# EAGLE design VelocistaEdu_soloshield (EAGLE 7.1.0)
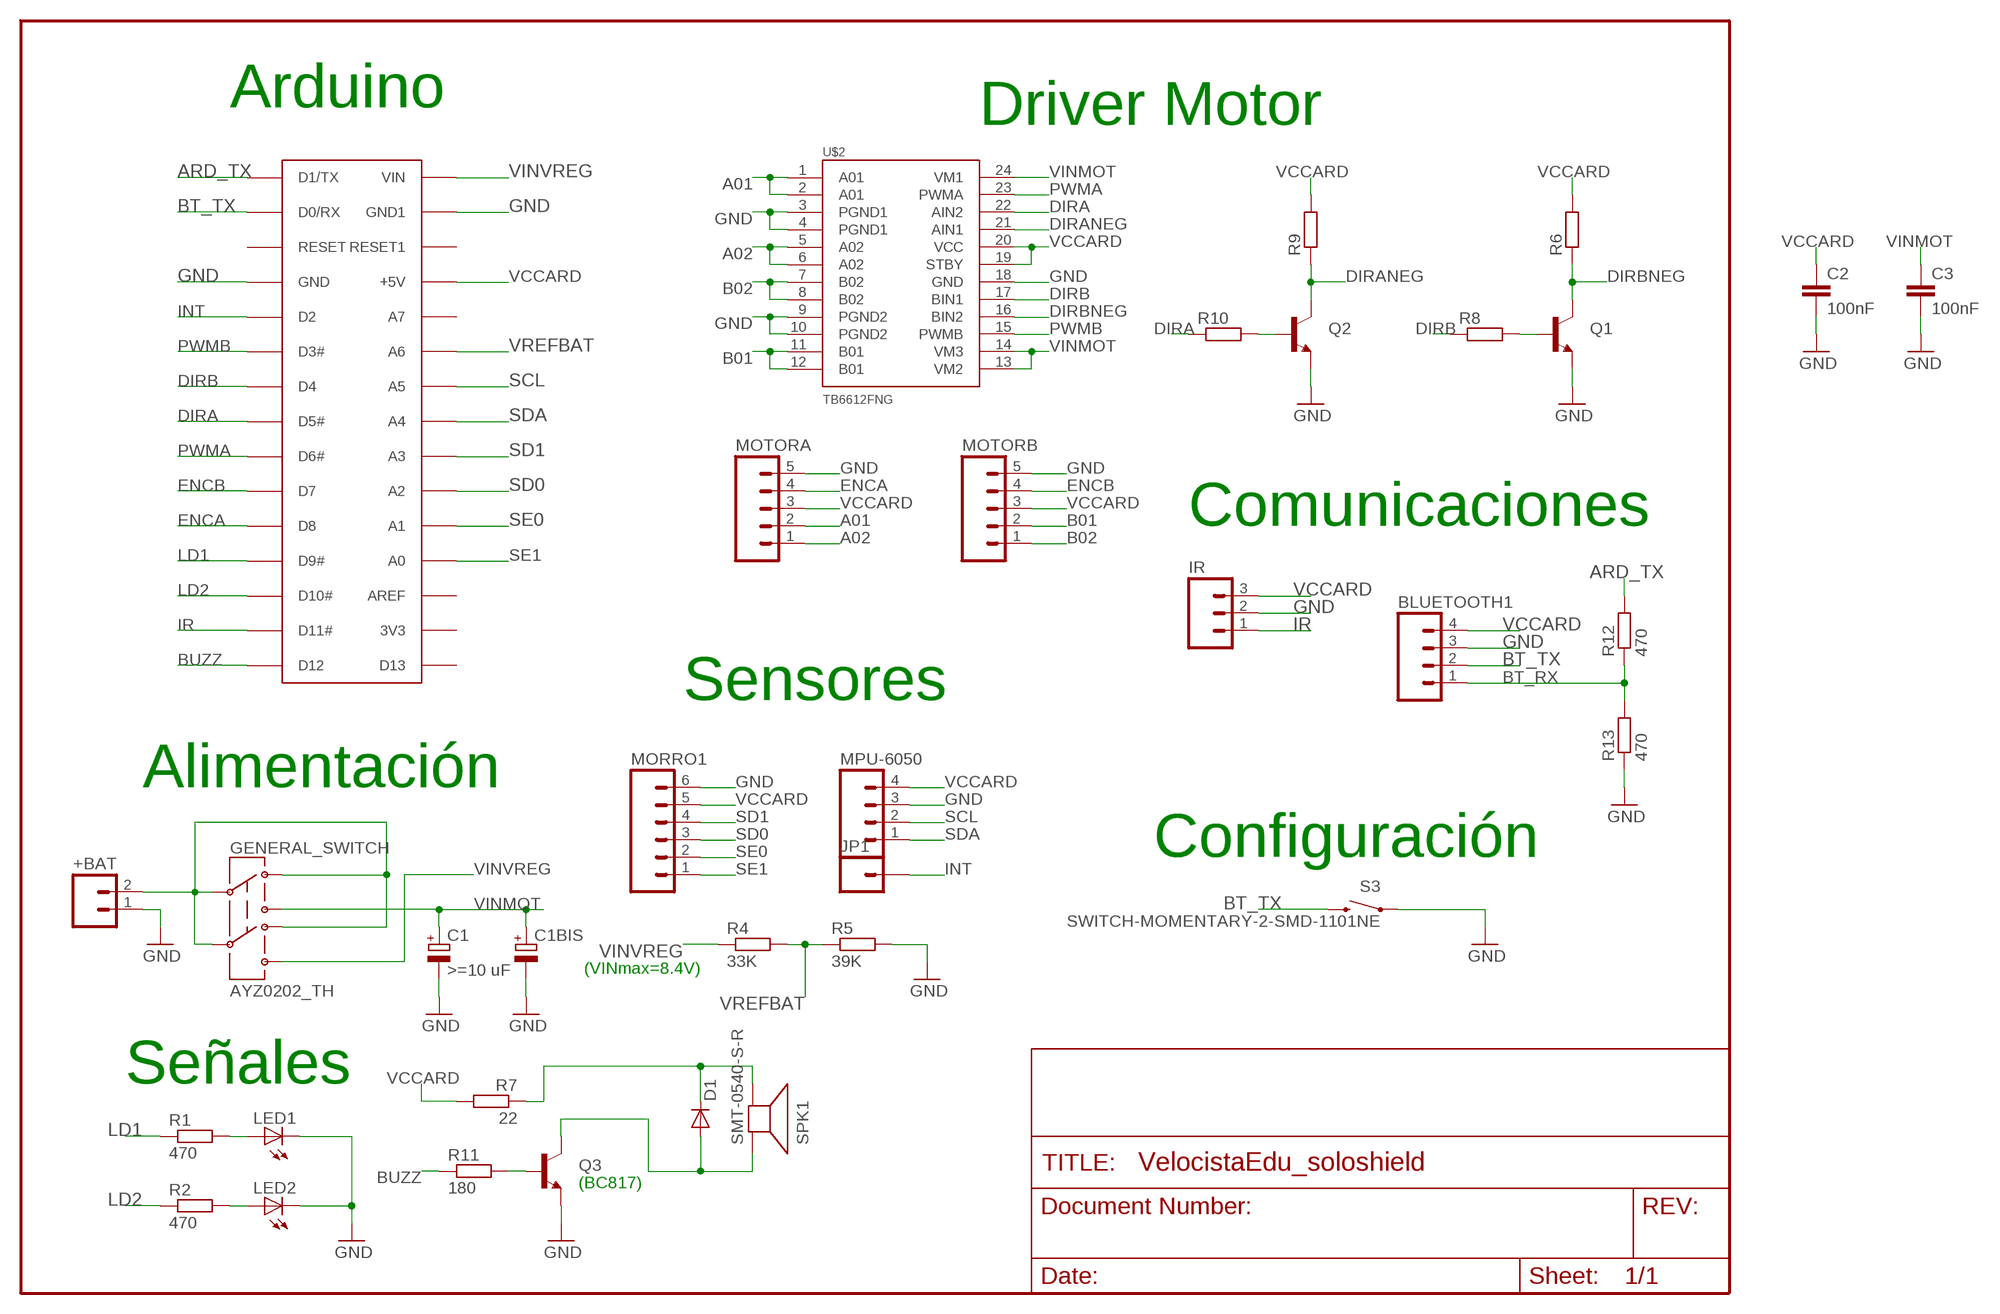
[diagram p0: schematic, sheet 1]

## Parts
+BAT  M02LOCK_LONGPADS  [1X02_LOCK_LONGPADS]
BLUETOOTH1  M04LONGPADS  [1X04_LONGPADS]
C1  >=10 uF  CPOL-EUSMCC  [SMC_C]
C1BIS  CPOL-EUE2.5-5  [E2,5-5]
C2  100nF  C-EUC0805  [C0805]
C3  100nF  C-EUC0805  [C0805]
D1  DIODE-MICROMELF-W  [MICROMELF-W]
GENERAL_SWITCH  AYZ0202_TH  [AYZ0202_TH]
IR  M03LONGPADS  [1X03_LONGPADS]
JP1  M01PTH_LONGPAD  [1X01_LONGPAD]
LED1  LEDCHIPLED_0805  [CHIPLED_0805]
LED2  LEDCHIPLED_0805  [CHIPLED_0805]
MORRO1  M06LONGPADS  [1X06_LONGPADS]
MOTORA  M05PTH  [1X05]
MOTORB  M05PTH  [1X05]
MPU-6050  M04LONGPADS  [1X04_LONGPADS]
Q1  TRANSISTOR_NPNSOT23  [SOT23]
Q2  TRANSISTOR_NPNSOT23  [SOT23]
Q3  TRANSISTOR_NPNSOT23  [SOT23]
R1  470  R-EU_R0805  [R0805]
R2  470  R-EU_R0805  [R0805]
R4  33K  R-EU_R0805  [R0805]
R5  39K  R-EU_R0805  [R0805]
R6  R-EU_M0805  [M0805]
R7  22  R-EU_R0805  [R0805]
R8  R-EU_M0805  [M0805]
R9  R-EU_M0805  [M0805]
R10  R-EU_M0805  [M0805]
R11  180  R-EU_M0805  [M0805]
R12  470  R-EU_R0805  [R0805]
R13  470  R-EU_R0805  [R0805]
S3  SWITCH-MOMENTARY-2-SMD-1101NE  [TACTILE-SWITCH-1101NE]
SPK1  SMT-0540-S-R  [SMT-0540-S-R]
U$1  ARDUINONANONOHOLES  [PDIP-32NOHOLES]
U$2  TB6612FNG  [SSOP24]

## Nets
A01: MOTORA.2 U$2.1(A01) U$2.2(A01)
A02: MOTORA.1 U$2.5(A02) U$2.6(A02)
ARD_TX: R12.2 U$1.D1/TX
B01: MOTORB.2 U$2.11(B01) U$2.12(B01)
B02: MOTORB.1 U$2.7(B02) U$2.8(B02)
BT_RX: BLUETOOTH1.1 R12.1 R13.2
BT_TX: BLUETOOTH1.2 S3.P$2 U$1.D0/RX
BUZZ: R11.1 U$1.D12
DIRA: R10.1 U$1.D5(D5#) U$2.22(AIN2)
DIRANEG: Q2.3(C) R9.1 U$2.21(AIN1)
DIRB: R8.1 U$1.D4 U$2.17(BIN1)
DIRBNEG: Q1.3(C) R6.1 U$2.16(BIN2)
ENCA: MOTORA.4 U$1.D8
ENCB: MOTORB.4 U$1.D7
GND: +BAT.1 BLUETOOTH1.3 C1.- C1BIS.- C2.2 C3.2 IR.2 LED1.C LED2.C MORRO1.6 MOTORA.5 MOTORB.5 MPU-6050.3 Q1.2(E) Q2.2(E) Q3.2(E) R5.2 R13.1 S3.P$1 U$1.GND U$1.GND1 U$2.3(PGND1) U$2.4(PGND1) U$2.9(PGND2) U$2.10(PGND2) U$2.18(GND)
INT: JP1.1 U$1.D2
IR: IR.1 U$1.D11(D11#)
LD1: R1.1 U$1.D9(D9#)
LD2: R2.1 U$1.D10(D10#)
N$1: +BAT.2 GENERAL_SWITCH.C1 GENERAL_SWITCH.C2 GENERAL_SWITCH.D1 GENERAL_SWITCH.D2
N$2: LED1.A R1.2
N$3: D1.C R7.1 SPK1.+(-)
N$5: LED2.A R2.2
N$6: Q2.1(B) R10.2
N$7: Q3.1(B) R11.2
N$8: D1.A Q3.3(C) SPK1.-(+)
N$9: Q1.1(B) R8.2
PWMA: U$1.D6(D6#) U$2.23(PWMA)
PWMB: U$1.D3(D3#) U$2.15(PWMB)
SCL: MPU-6050.2 U$1.A5
SD0: MORRO1.3 U$1.A2
SD1: MORRO1.4 U$1.A3
SDA: MPU-6050.1 U$1.A4
SE0: MORRO1.2 U$1.A1
SE1: MORRO1.1 U$1.A0
VCCARD: BLUETOOTH1.4 C2.1 IR.3 MORRO1.5 MOTORA.3 MOTORB.3 MPU-6050.4 R6.2 R7.2 R9.2 U$1.+5V U$2.19(STBY) U$2.20(VCC)
VINMOT: C1.+ C1BIS.+ C3.1 GENERAL_SWITCH.B1 U$2.13(VM2) U$2.14(VM3) U$2.24(VM1)
VINVREG: GENERAL_SWITCH.B2 R4.1 U$1.VIN
VREFBAT: R4.2 R5.1 U$1.A6
Unconnected: U$1.3V3 U$1.A7 U$1.AREF U$1.D13 U$1.RESET U$1.RESET1

## Notes on the sheet
- Arduino | Driver Motor
- Comunicaciones
- Sensores
- Alimentación
- Configuración
- (VINmax=8.4V)
- Señales
- (BC817)

## Library data of the parts
+BAT = SparkFun:M02: Header 2 Standard 2-pin 0.1" header. Use with straight break away headers (SKU : PRT-00116), right angle break away headers (PRT-00553), swiss pins (PRT-00743), machine pins (PRT-00117), and female headers (PRT-00115). Molex polarized connector foot print use with SKU : PRT-08233 with associated crimp pins and housings.
BLUETOOTH1 MPU-6050 = SparkFun:M04: Header 4 Standard 4-pin 0.1" header. Use with straight break away headers (SKU : PRT-00116), right angle break away headers (PRT-00553), swiss pins (PRT-00743), machine pins (PRT-00117), and female headers (PRT-00115). Molex polarized connector foot print use with SKU : PRT-08231 with associated crimp pins and housings. 1MM SMD Version SKU: PRT-10208
C1 C1BIS = rcl:CPOL-EU: POLARIZED CAPACITOR, European symbol
C2 C3 = rcl:C-EU: CAPACITOR, European symbol
D1 = diode:DIODE-: DIODE
GENERAL_SWITCH = 1r_BAT_guissona:AYZ0202_TH
IR = SparkFun:M03: Header 3 Standard 3-pin 0.1" header. Use with straight break away headers (SKU : PRT-00116), right angle break away headers (PRT-00553), swiss pins (PRT-00743), machine pins (PRT-00117), and female headers (PRT-00115). Molex polarized connector foot print use with SKU : PRT-08232 with associated crimp pins and housings.
JP1 = SparkFun-Connectors:M01: Header 1 Standard 1-pin 0.1" header. Use with straight break away headers (SKU : PRT-00116), right angle break away headers (PRT-00553), swiss pins (PRT-00743), machine pins (PRT-00117), and female headers (PRT-00115).
LED1 LED2 = led:LED: LED OSRAM: - CHIPLED LG R971, LG N971, LY N971, LG Q971, LY Q971, LO R971, LY R971 LH N974, LH R974 LS Q976, LO Q976, LY Q976 LO Q996 - Hyper CHIPLED LW Q18S LB Q993, LB Q99A, LB R99A - SideLED LS A670, LO A670, LY A670, LG A670, LP A670 LB A673, LV A673, LT A673, LW A673 LH A674 LY A675 LS A676, LA A676, LO A676, LY A676, LW A676 LS A679, LY A679, LG A679 - Hyper Micro SIDELED® LS Y876, LA Y876, LO Y876, LY Y876 LT Y87S - SmartLED LW L88C, LW L88S LB L89C, LB L89S, LG L890 LS L89K, LO L89K, LY L89K LS L896, LA L896, LO L896, LY L896 - TOPLED LS T670, LO T670, LY T670, LG T670, LP T670 LSG T670, LSP T670, LSY T670, LOP T670, LYG T670 LG T671, LOG T671, LSG T671 LB T673, LV T673, LT T673, LW T673 LH T674 LS T676, LA T676, LO T676, LY T676, LB T676, LH T676, LSB T676, LW T676 LB T67C, LV T67C, LT T67C, LS T67K, LO T67K, LY T67K, LW E67C LS E67B, LA E67B, LO E67B, LY E67B, LB E67C, LV E67C, LT E67C LW T67C LS T679, LY T679, LG T679 LS T770, LO T770, LY T770, LG T770, LP T770 LB T773, LV T773, LT T773, LW T773 LH T774 LS E675, LA E675, LY E675, LS T675 LS T776, LA T776, LO T776, LY T776, LB T776 LHGB T686 LT T68C, LB T68C - Hyper Mini TOPLED® LB M676 - Mini TOPLED Santana® LG M470 LS M47K, LO M47K, LY M47K Source: http://www.osram.convergy.de LUXEON: - LUMILED® LXK2-PW12-R00, LXK2-PW12-S00, LXK2-PW14-U00, LXK2-PW14-V00 LXK2-PM12-R00, LXK2-PM12-S00, LXK2-PM14-U00 LXK2-PE12-Q00, LXK2-PE12-R00, LXK2-PE12-S00, LXK2-PE14-T00, LXK2-PE14-U00 LXK2-PB12-K00, LXK2-PB12-L00, LXK2-PB12-M00, LXK2-PB14-N00, LXK2-PB14-P00, LXK2-PB14-Q00 LXK2-PR12-L00, LXK2-PR12-M00, LXK2-PR14-Q00, LXK2-PR14-R00 LXK2-PD12-Q00, LXK2-PD12-R00, LXK2-PD12-S00 LXK2-PH12-R00, LXK2-PH12-S00 LXK2-PL12-P00, LXK2-PL12-Q00, LXK2-PL12-R00 Source: www.luxeon.com KINGBRIGHT: KA-3528ASYC Source: www.kingbright.com
MORRO1 = SparkFun:M06: Header 6 Standard 6-pin 0.1" header. Use with straight break away headers (SKU : PRT-00116), right angle break away headers (PRT-00553), swiss pins (PRT-00743), machine pins (PRT-00117), and female headers (PRT-00115). Molex polarized connector foot print use with SKU : PRT-08094 with associated crimp pins and housings. NOTES ON THE VARIANTS LOCK and LOCK_LONGPADS... This footprint was designed to help hold the alignment of a through-hole component (i.e. 6-pin header) while soldering it into place. You may notice that each hole has been shifted either up or down by 0.005 of an inch from it's more standard position (which is a perfectly straight line). This slight alteration caused the pins (the squares in the middle) to touch the edges of the holes. Because they are alternating, it causes a "brace" to hold the component in place. 0.005 has proven to be the perfect amount of "off-center" position when using our standard breakaway headers. Although looks a little odd when you look at the bare footprint, once you have a header in there, the alteration is very hard to notice. Also, if you push a header all the way into place, it is covered up entirely on the bottom side. This idea of altering the position of holes to aid alignment will be further integrated into the Sparkfun Library for other footprints. It can help hold any component with 3 or more connection pins.
MOTORA MOTORB = SparkFun-Connectors:M05: Header 5 Standard 5-pin 0.1" header. Use with straight break away headers (SKU : PRT-00116), right angle break away headers (PRT-00553), swiss pins (PRT-00743), machine pins (PRT-00117), and female headers (PRT-00115). Molex polarized connector foot print use with SKU : PRT-08230 with associated crimp pins and housings.
Q1-Q3 = SparkFun:TRANSISTOR_NPN: Transistor NPN BJT configuration in SOT23 package. MMBT2222 is the common NPN we use. Double check BCE configuration again layout.
R1 R2 R4 R5 R7 R12 R13 = resistor:R-EU_: RESISTOR, European symbol
R6 R8-R11 = rcl:R-EU_: RESISTOR, European symbol
S3 = SparkFun-Electromechanical:SWITCH-MOMENTARY-2: Various NO switches- pushbuttons, reed, etc
SPK1 = adafruit:SMT-0540-S-R: SMT-0549-S-R Small surface-mount magnetic buzzer
U$1 = jet-lib:ARDUINONANO
U$2 = SparkFun-PowerIC:TB6612FNG: Toshiba 1A dual motor driver IC-09363; PROD_ID: IC-09363

## Board
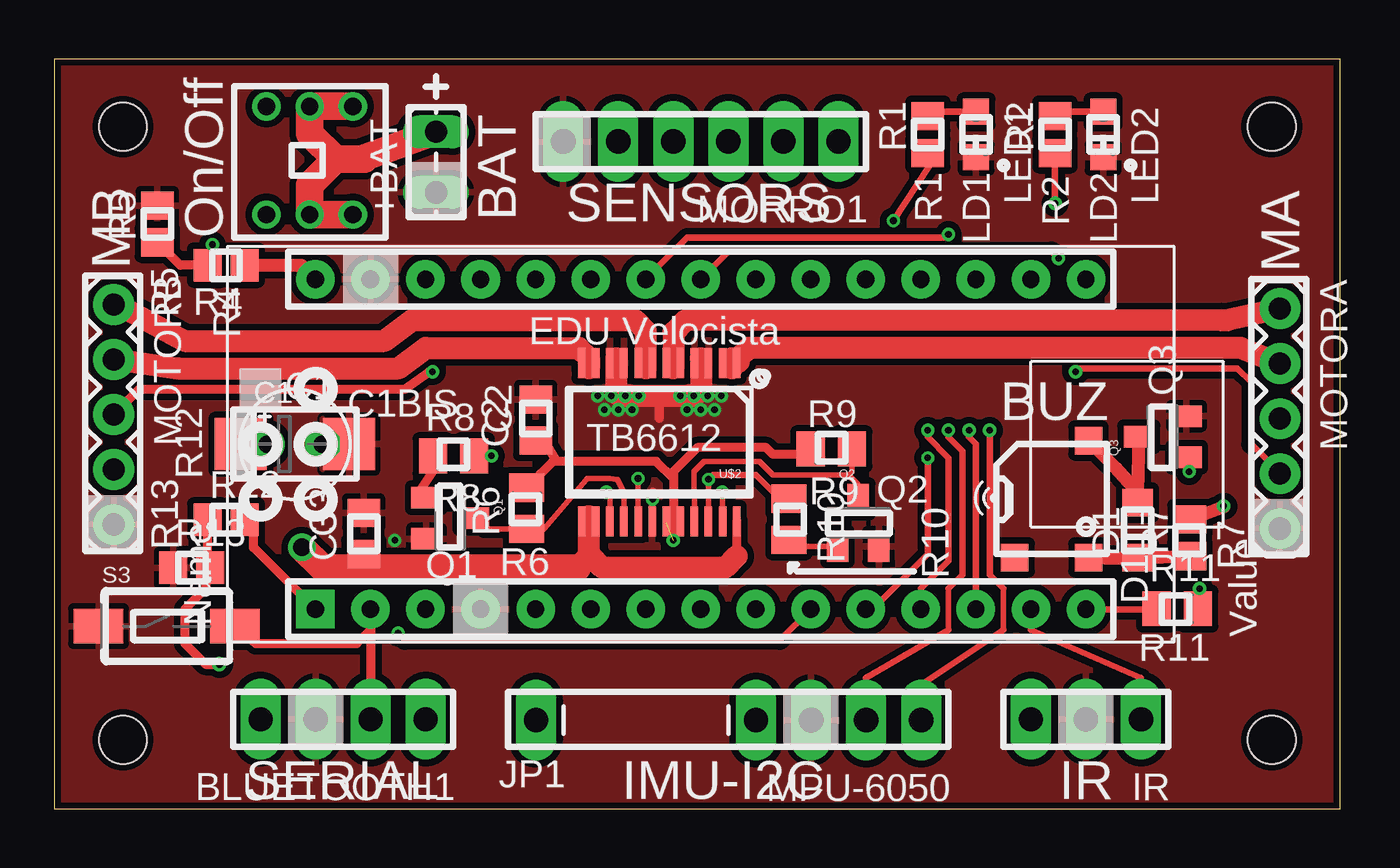
[diagram p1: board, top side]
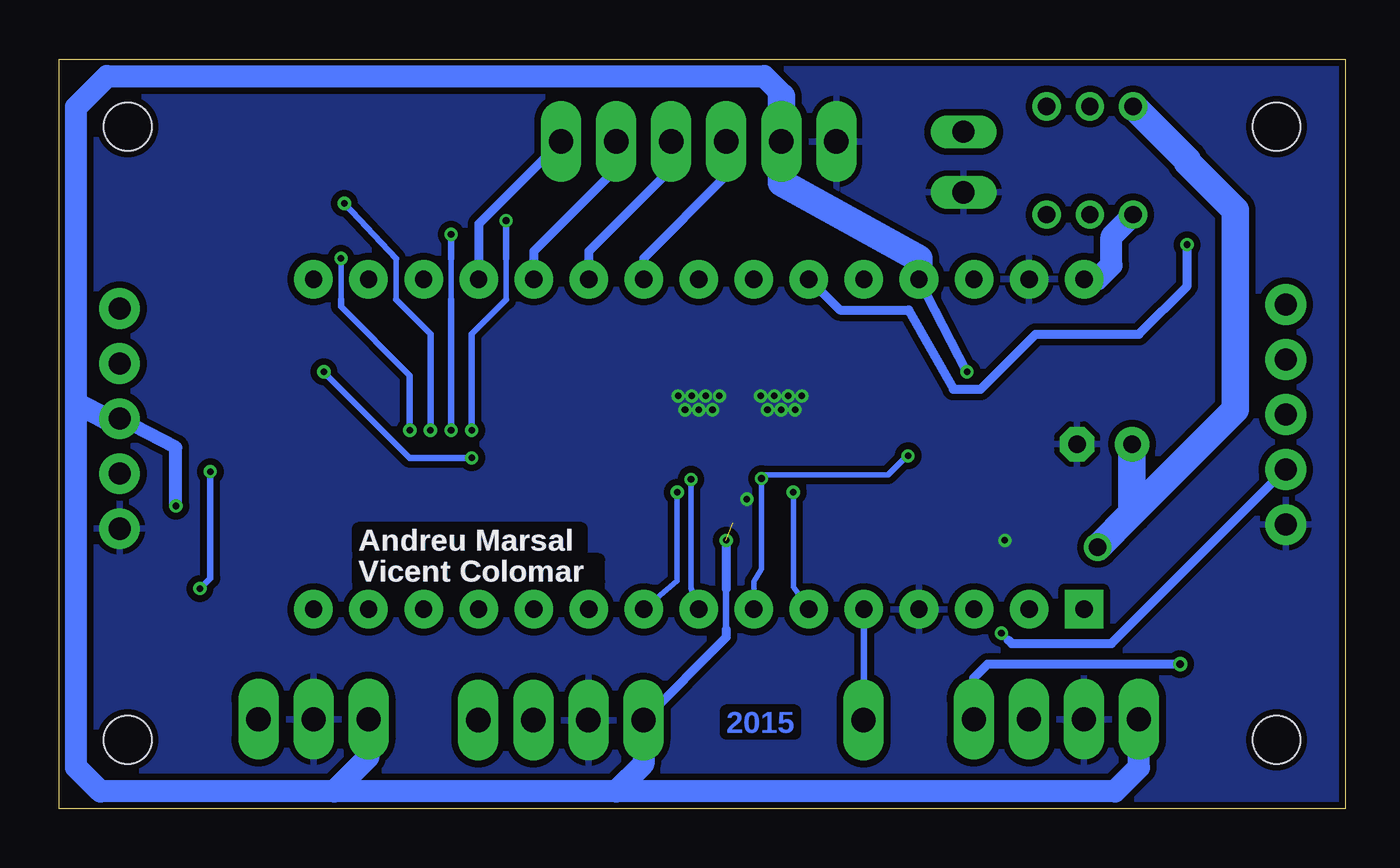
[diagram p2: board, bottom side, seen from below]

Size 59.36 x 34.6 mm. Coordinates in mm from the lower left corner, seen from the top.
Outline: 0,0 59.36,0 59.36,34.6 0,34.6 0,0
Copper layers (1*16): Top 0.035mm / dielectric 1.5mm / Bottom 0.035mm
Design rules "Elecrow_2-layer_eagle_rule": minimum track width 6mil, minimum drill 12mil, track to track 6mil, track to pad 6mil, pad to pad 6mil, via to via 6mil, smd to smd 0mil, copper to edge 10mil, drill to drill 10mil, minimum pad ring 10mil, minimum via ring 6mil, stop-mask expansion 2mil, vias tented up to drill 100mil, thermal gap 10mil
Holes 2.2 mm at 56.2,31.48 56.2,3.17 3.17,31.48 3.17,3.17

### Footprints (pad centres in the part's own frame; a part is rotated, then mirrored left to right if it is on the bottom)
1X02_LOCK_LONGPADS = drill 1.016 long: 1 -0.127,0; 2 2.667,0
1X04_LONGPADS = drill 1.118 pad 1.88 long: 1 0,0; 2 2.54,0; 3 5.08,0; 4 7.62,0
SMC_C = smd 2.4 x 2.4: + -2.5,0; - 2.5,0
E2,5-5 = drill 0.813 pad 1.6: + -1.27,0 | drill 0.813 pad 1.6 octagon: - 1.27,0
C0805 = smd 1.3 x 1.5: 1 -0.95,0; 2 0.95,0
MICROMELF-W = smd 1.27 x 1.4: A 1.268,0; C -1.268,0
AYZ0202_TH = drill 0.8: B1 -2.5,-2; B2 2.5,-2; C1 -2.5,0; C2 2.5,0; D1 -2.5,2; D2 2.5,2
1X03_LONGPADS = drill 1.118 pad 1.88 long: 1 0,0; 2 2.54,0; 3 5.08,0
1X01_LONGPAD = drill 1.118 pad 1.88 long: 1 0,0
CHIPLED_0805 = smd 1.2 x 1.2: A 0,-1.05; C 0,1.05
1X06_LONGPADS = drill 1.118 pad 1.88 long: 1 0,0; 2 2.54,0; 3 5.08,0; 4 7.62,0; 5 10.16,0; 6 12.7,0
1X05 = drill 1.016 pad 1.88: 1 0,0; 2 2.54,0; 3 5.08,0; 4 7.62,0; 5 10.16,0
SOT23 = smd 1 x 1.4: 1 -0.95,-1.1; 2 0.95,-1.1; 3 0,1.1
R0805 = smd 1.3 x 1.5: 1 -0.85,0; 2 0.85,0
M0805 = smd 1.3 x 1.6: 1 -0.95,0; 2 0.95,0
TACTILE-SWITCH-1101NE = smd 2.3 x 1.6: P$1 -3.15,0; P$2 3.15,0
SMT-0540-S-R = smd 1.27 x 1.27: + 1.7,-2.7; - 1.7,2.7; M -1.7,-2.7
PDIP-32NOHOLES = drill 0.8 pad 1.778: 3V3 7.62,-15.24; +5V 7.62,10.16; A0 7.62,-10.16; A1 7.62,-7.62; A2 7.62,-5.08; A3 7.62,-2.54; A4 7.62,0; A5 7.62,2.54; A6 7.62,5.08; A7 7.62,7.62; AREF 7.62,-12.7; D0/RX -7.62,15.24; D2 -7.62,7.62; D3 -7.62,5.08; D4 -7.62,2.54; D5 -7.62,0; D6 -7.62,-2.54; D7 -7.62,-5.08; D8 -7.62,-7.62; D9 -7.62,-10.16; D10 -7.62,-12.7; D11 -7.62,-15.24; D12 -7.62,-17.78; D13 7.62,-17.78; GND -7.62,10.16; GND1 7.62,15.24; RESET -7.62,12.7; RESET1 7.62,12.7; VIN 7.62,17.78 | drill 0.8 pad 1.778 square: D1/TX -7.62,17.78
SSOP24 = smd 0.348 x 1.397: 1 -3.575,-3.656; 2 -2.925,-3.656; 3 -2.275,-3.656; 4 -1.625,-3.656; 5 -0.975,-3.656; 6 -0.325,-3.656; 7 0.325,-3.656; 8 0.975,-3.656; 9 1.625,-3.656; 10 2.275,-3.656; 11 2.925,-3.656; 12 3.575,-3.656; 13 3.575,3.656; 14 2.925,3.656; 15 2.275,3.656; 16 1.625,3.656; 17 0.975,3.656; 18 0.325,3.656; 19 -0.325,3.656; 20 -0.975,3.656; 21 -1.625,3.656; 22 -2.275,3.656; 23 -2.925,3.656; 24 -3.575,3.656

### Placement (x,y rotation side)
+BAT  17.62,28.57 90 top
BLUETOOTH1  17.14,4.13 180 top
C1  11.11,16.83 0 top
C1BIS  11.11,16.83 0 top
C2  22.23,17.94 90 top
C3  14.29,12.7 90 top
D1  50.01,12.86 90 top
GENERAL_SWITCH  11.79,29.92 270 top
IR  50.16,4.13 180 top
JP1  22.24,4.08 180 top
LED1  42.55,31.11 180 top
LED2  48.42,31.11 180 top
MORRO1  36.2,30.8 180 top
MOTORA  56.58,23.08 270 top
MOTORB  2.75,23.27 270 top
MPU-6050  40.02,4.09 180 top
Q1  18.28,13.41 270 top
Q2  37.11,13.2 0 top
Q3  51.16,17.17 90 top
R1  40.32,31.11 90 top
R2  46.2,31.11 90 top
R4  7.94,25.08 180 top
R5  4.76,26.99 90 top
R6  21.81,13.87 90 top
R7  52.42,12.5 90 top
R8  18.44,16.28 180 top
R9  35.87,16.6 180 top
R10  33.91,13.36 270 top
R11  51.83,9.23 0 top
R12  7.94,13.34 0 top
R13  6.35,11.11 0 top
S3  5.2,8.42 0 top
SPK1  46.04,14.29 0 top
U$1  29.84,16.82 90 top
U$2  27.93,16.92 180 top

### Tracks (layer width: path | path; a pad name or v marks a point on that pad's centre or on a via)
A01
  Top 0.254: U$2.1 31.43,20.48 31.27,20.48 | 31.27,20.64 30.96,20.64 U$2.2
  Top 1.016: 31.27,20.32 31.27,20.48 31.27,20.64 31.27,20.8 31.59,20.64 31.59,20.8 32.07,21.27 54.77,21.27 MOTORA.2
A02
  Top 0.254: U$2.5 28.89,20.48 28.57,20.48 | 28.57,20.64 28.26,20.64 U$2.6
  Top 1.016: 28.57,20.32 28.57,20.48 28.57,20.64 28.57,21.99 29.11,22.53 53.9,22.54 54.13,22.54 MOTORA.1
ARD_TX
  Top 0.406: U$1.D1/TX 9.21,12.06 9.21,13.34 R12.2
B01
  Top 0.254: U$2.11 24.92,20.48 24.69,20.48 | 24.69,20.64 24.45,20.64 U$2.12
  Top 1.016: 24.69,20.32 24.69,20.48 24.69,20.64 24.69,20.8 24.21,21.27 17.14,21.27 15.88,20.32 5.71,20.32 2.92,20.73 MOTORB.2
B02
  Top 0.254: U$2.7 27.46,20.48 27.3,20.48 | 27.3,20.64 26.99,20.64 U$2.8
  Top 1.016: 27.3,20.32 27.3,20.48 27.3,20.64 27.3,22.07 26.83,22.54 16.51,22.54 15.24,21.59 6.03,21.59 2.92,23.27 MOTORB.1
BT_RX  (via drill 0.35)
  Top 0.406: v7.62,6.67 6.99,6.67 6.03,7.62 6.03,9.21 6.99,10.16 6.99,11.11 R13.2 7.09,11.11 R12.1
  Bottom 0.406: v7.62,6.67 16.51,6.67 17.14,6.03 BLUETOOTH1.1
BT_TX
  Top 0.305: U$1.D0/RX
  Top 0.406: U$1.D0/RX BLUETOOTH1.2 | S3.P$2 9.31,7.62 13.97,7.62 14.6,8.25 U$1.D0/RX
BUZZ
  Top 0.305: U$1.D12 50.85,9.2 R11.1
DIRA  (via drill 0.3 pad 0.61)
  Top 0.254: U$2.22 30.2,15.04 v30.2,15.2
  Top 0.305: v30.2,15.2 30.4,15.4 32.38,15.4 33.48,14.31 R10.1
  Bottom 0.254: U$1.D5 30.2,10.2 v30.2,15.2
DIRANEG
  Top 0.254: U$2.21 29.55,14.58 29.53,14.61 29.53,15.56 30,16.03 32.54,16.03 33.18,15.4 36.67,15.4 | 36.67,15.4 37.11,14.96 Q2.3 | R9.1 36.82,15.55 36.67,15.4
DIRB  (via drill 0.3 pad 0.61)
  Top 0.254: U$2.17 v26.95,15.24
  Top 0.305: v20.18,16.28 R8.1
  Bottom 0.254: U$1.D4 27.3,10.48 26.94,11.07 26.95,12.02 v26.95,15.24 26.95,15.28 26.83,15.4 21.11,15.4 20.23,16.28 v20.18,16.28
DIRBNEG
  Top 0.254: 18.89,13.49 Q1.3 19.87,12.92 R6.1 22.6,12.92 24.55,15.18 24.61,15.24 25.64,15.24 26,15.2 26.3,14.58 U$2.16
ENCA  (via drill 0.3 pad 0.61)
  Top 0.305: U$1.D8 37.78,9.2 40.32,11.75 v40.32,16.19 | v47.15,20.16 47.31,20.32 54.61,20.32 55.24,19.68 55.24,16.83 56.52,15.56 MOTORA.4
  Bottom 0.305: v40.32,16.19 43.18,16.19 v47.15,20.16
ENCB  (via drill 0.3 pad 0.61)
  Top 0.305: U$1.D7 33.5,7.78 16.19,7.78 v15.88,8.1
  Bottom 0.305: v15.88,8.1 15.56,7.78
  Bottom 0.406: 15.56,7.78 15.4,7.62 10.79,7.62 2.76,15.65 MOTORB.4
GND  (via drill 0.3 pad 0.61)
  Top 0.305: U$2.18 27.6,14.27 v27.62,14.29
  Top 0.406: 27.94,18.02 27.94,18.97 27.86,19.05 | v27.62,14.29 27.62,14.61
  Top 1.016: 29.84,20.8 29.84,19.37 v29.53,19.05 27.86,19.05 26.11,19.05 25.96,19.21 25.96,20.8
  other vias: 26.35,19.05 30.16,19.05 25.72,19.05 15.72,12.38 25.08,19.05 26.99,19.05 26.04,18.41 25.4,18.41 26.67,18.41 28.89,19.05 30.8,19.05 29.21,18.41 29.84,18.41 30.48,18.41
  pour Bottom (isolate 0.305): 0,0 59.69,0 59.69,34.61 0,34.61
  pour Top (isolate 0.305): 0,0 59.69,0 59.69,34.61 0,34.61
INT
  Bottom 0.305: U$1.D2 22.22,4.1 JP1.1
IR
  Top 0.305: U$1.D11 45.08,8.26 50.16,6.03 IR.1
LD1  (via drill 0.3 pad 0.61)
  Top 0.305: U$1.D9 40,10.16 41.27,11.43 41.27,16.19 40.32,17.14 v40.32,17.46 | v38.73,27.15 40.38,29.63 R1.1
  Bottom 0.254: 38.73,23.5 38.73,25.4
  Bottom 0.305: v40.32,17.46 40.32,21.91 38.73,23.5 | 38.73,25.4 v38.73,27.15
LD2  (via drill 0.3 pad 0.61)
  Top 0.305: U$1.D10 42.54,16.83 42.23,17.14 v42.23,17.46 | R2.1 v46.2,27.94
  Bottom 0.254: 43.81,23.5 43.81,25.4
  Bottom 0.305: v42.23,17.46 42.23,21.91 43.81,23.5 | 43.81,25.4 v46.2,27.94
N$1
  Top 1.27: 12.99,29.97 11.79,28.77 GENERAL_SWITCH.C2 GENERAL_SWITCH.D2 | 12.99,29.97 11.79,31.17 GENERAL_SWITCH.C1 GENERAL_SWITCH.D1 | 12.99,29.97 14.13,29.97 | 14.13,29.97 14.32,29.97 | +BAT.2 14.13,29.97
N$2
  Top 0.305: LED1.A 40.52,32.16 R1.2
N$3
  Top 0.61: R7.1 50.01,11.56 | 50.01,11.56 48.5,11.56 SPK1.+ | D1.C 50.01,11.56
N$5
  Top 0.305: LED2.A 46,32.16 R2.2
N$6
  Top 0.254: Q2.1 34.23,12.1 R10.2
N$7  (via drill 0.3 pad 0.61)
  Top 0.305: R11.2 52.78,10.08 v52.86,10.16 | v52.39,15.56 52.39,16.1 Q3.1
  Bottom 0.305: v52.86,10.16 52.39,10.64 v52.39,15.56
N$8
  Top 0.61: Q3.3 50.01,14.63 | 50.01,14.63 48.98,15.74 SPK1.- | D1.A 50.01,14.63
N$9
  Top 0.254: 16.83,14.29 Q1.1
  Top 0.406: 16.83,14.29 16.83,14.61 17.46,15.56 17.46,15.94 R8.2
PWMA  (via drill 0.3 pad 0.61)
  Top 0.254: U$2.23 30.85,14.59 v30.84,14.61
  Bottom 0.254: U$1.D6 30.84,10.51 v30.84,14.61
PWMB  (via drill 0.3 pad 0.61)
  Top 0.254: U$2.15 25.65,14.43 v25.48,14.61
  Bottom 0.254: U$1.D3 25.48,10.24 v25.48,14.61
SCL  (via drill 0.3 pad 0.61)
  Top 0.254: 41.27,10.16 41.27,8.26
  Top 0.305: U$1.A5 29.21,26.35 41.12,26.35 v41.27,26.51 | v41.27,17.46 41.27,17.14 41.91,16.51 41.91,10.79 41.27,10.16 | MPU-6050.2 37.47,4.1 37.47,6.03 41.27,8.26
  Bottom 0.254: 41.27,25.4 41.27,23.5
  Bottom 0.305: v41.27,26.51 41.27,25.4 | 41.27,23.5 v41.27,17.46
SD0
  Bottom 0.406: MORRO1.3 31.11,29.53 34.92,25.72 U$1.A2
SD1
  Bottom 0.406: MORRO1.4 28.57,29.21 32.38,25.4 U$1.A3
SDA  (via drill 0.3 pad 0.61)
  Top 0.254: 43.81,10.16 43.81,8.26
  Top 0.305: U$1.A4 31.11,25.72 46.04,25.72 v46.35,25.4 | v43.18,17.46 43.18,10.79 43.81,10.16 | MPU-6050.1 40.01,4.1 40.01,5.71 43.81,8.26
  Bottom 0.254: v46.35,25.4 46.35,23.5
  Bottom 0.305: 46.35,23.5 46.35,23.18 43.18,20 v43.18,17.46
SE0
  Bottom 0.406: MORRO1.2 33.66,29.53 37.47,25.72 U$1.A1
SE1
  Bottom 0.406: MORRO1.1 40.01,26.99 U$1.A0
VCCARD  (via drill 0.3 pad 0.61)  (1 unrouted)
  Top 0.254: U$2.19 28.26,13.18 28.89,13.18 U$2.20 28.89,13.34
  Top 0.305: R9.2 34.61,16.5 34.45,16.35
  Top 0.406: 34.45,16.35 33.18,16.35 32.86,16.67 29.69,16.67 28.57,15.56 28.57,15.24 | 28.57,15.24 27.78,16.03 23.18,16.03 | 23.18,16.03 23.02,16.03 22.44,15.46 R6.2 | 28.57,15.24 v28.57,12.38 | MOTORB.3 3.93,19.37 16.19,19.37 17.3,20.16 v17.46,20.16 | C2.1 22.39,16.82 22.71,16.82 23.18,16.03
  Top 0.61: R7.2 54.01,13.94 v53.98,13.97
  Bottom 0.305: 28.57,10.16 28.57,8.26
  Bottom 0.406: v28.57,12.38 28.57,10.16 | 28.57,8.26 28.57,7.91 MPU-6050.4 | v17.46,20.16 U$1.+5V
  Bottom 0.61: v53.98,13.97 53.98,16.67 MOTORA.3
  Bottom 1.016: 26.04,32.86 25.96,32.94 26.83,33.81 57.15,33.81 58.58,32.38 58.58,18.73 | 58.58,18.73 58.58,1.91 57.47,0.79 46.67,0.79 | MOTORA.3 57.21,18 58.58,18.73 | IR.3 45.09,2.38 46.67,0.79 | 33.66,0.79 10.64,0.79 9.53,1.91 BLUETOOTH1.4 | MPU-6050.4 32.4,2.05 33.66,0.79 | 33.66,0.79 46.67,0.79
  Bottom 1.27: U$1.+5V 19.68,25.4 26.04,28.89 MORRO1.5 26.04,32.86
VINMOT  (via drill 0.8 pad 1.27)
  Top 0.254: U$2.14 24.92,13.18 24.69,13.18 | 24.69,12.86 24.61,12.86 U$2.13
  Top 0.305: C3.1 14.29,11.11
  Top 0.406: U$2.24 31.5,11.66
  Top 1.016: 31.5,11.66 30.96,11.11 25.32,11.11 24.73,11.71 | 24.73,11.71 24.69,11.75 24.69,12.86 24.69,13.18 24.69,13.49 | 24.13,11.11 24.73,11.71
  Top 1.27: v11.43,12.06 12.38,11.11 14.29,11.11 24.13,11.11 | C1.+ C1BIS.+
  Bottom 1.27: GENERAL_SWITCH.B1 7.3,29.93 7.3,29.84 5.08,27.62 5.08,18.41 9.84,13.65 | 9.84,13.65 v11.43,12.06 | C1BIS.+ 9.84,13.65
VINVREG
  Top 0.61: R4.1 11.42,25.08 U$1.VIN
  Bottom 1.016: U$1.VIN 11.44,24.44 10.79,25.08 10.79,26.41 GENERAL_SWITCH.B2
VREFBAT  (via drill 0.3 pad 0.61)
  Top 0.406: R5.1 5.82,25.08 R4.2 7.3,25.5 v7.3,26.04
  Bottom 0.406: U$1.A6 23.34,23.02 20.16,23.02 18.1,19.37 16.83,19.37 14.29,21.91 9.53,21.91 7.3,24.13 v7.3,26.04

### Text on the board
Bottom: Andreu Marsal | Vicent Colomar | 2015
_tsilk: BAT | SENSORS | R1 | LD1 | R2 | LD2 | On/Off | MB | MA | R5 | EDU Velocista | R4 | C1 | Q3 | TB6612 | R9 | BUZ | R8 | C2 | R13 | R12 | Q2 | C3 | R7 | Q1 | R6 | D1 | R10 | R11 | SERIAL | IMU-I2C | IR
_bsilk: Andreu Marsal | Vicent Colomar